# EAGLE schematic Paralysis_Assist_v1 (EAGLE 9.6.2)
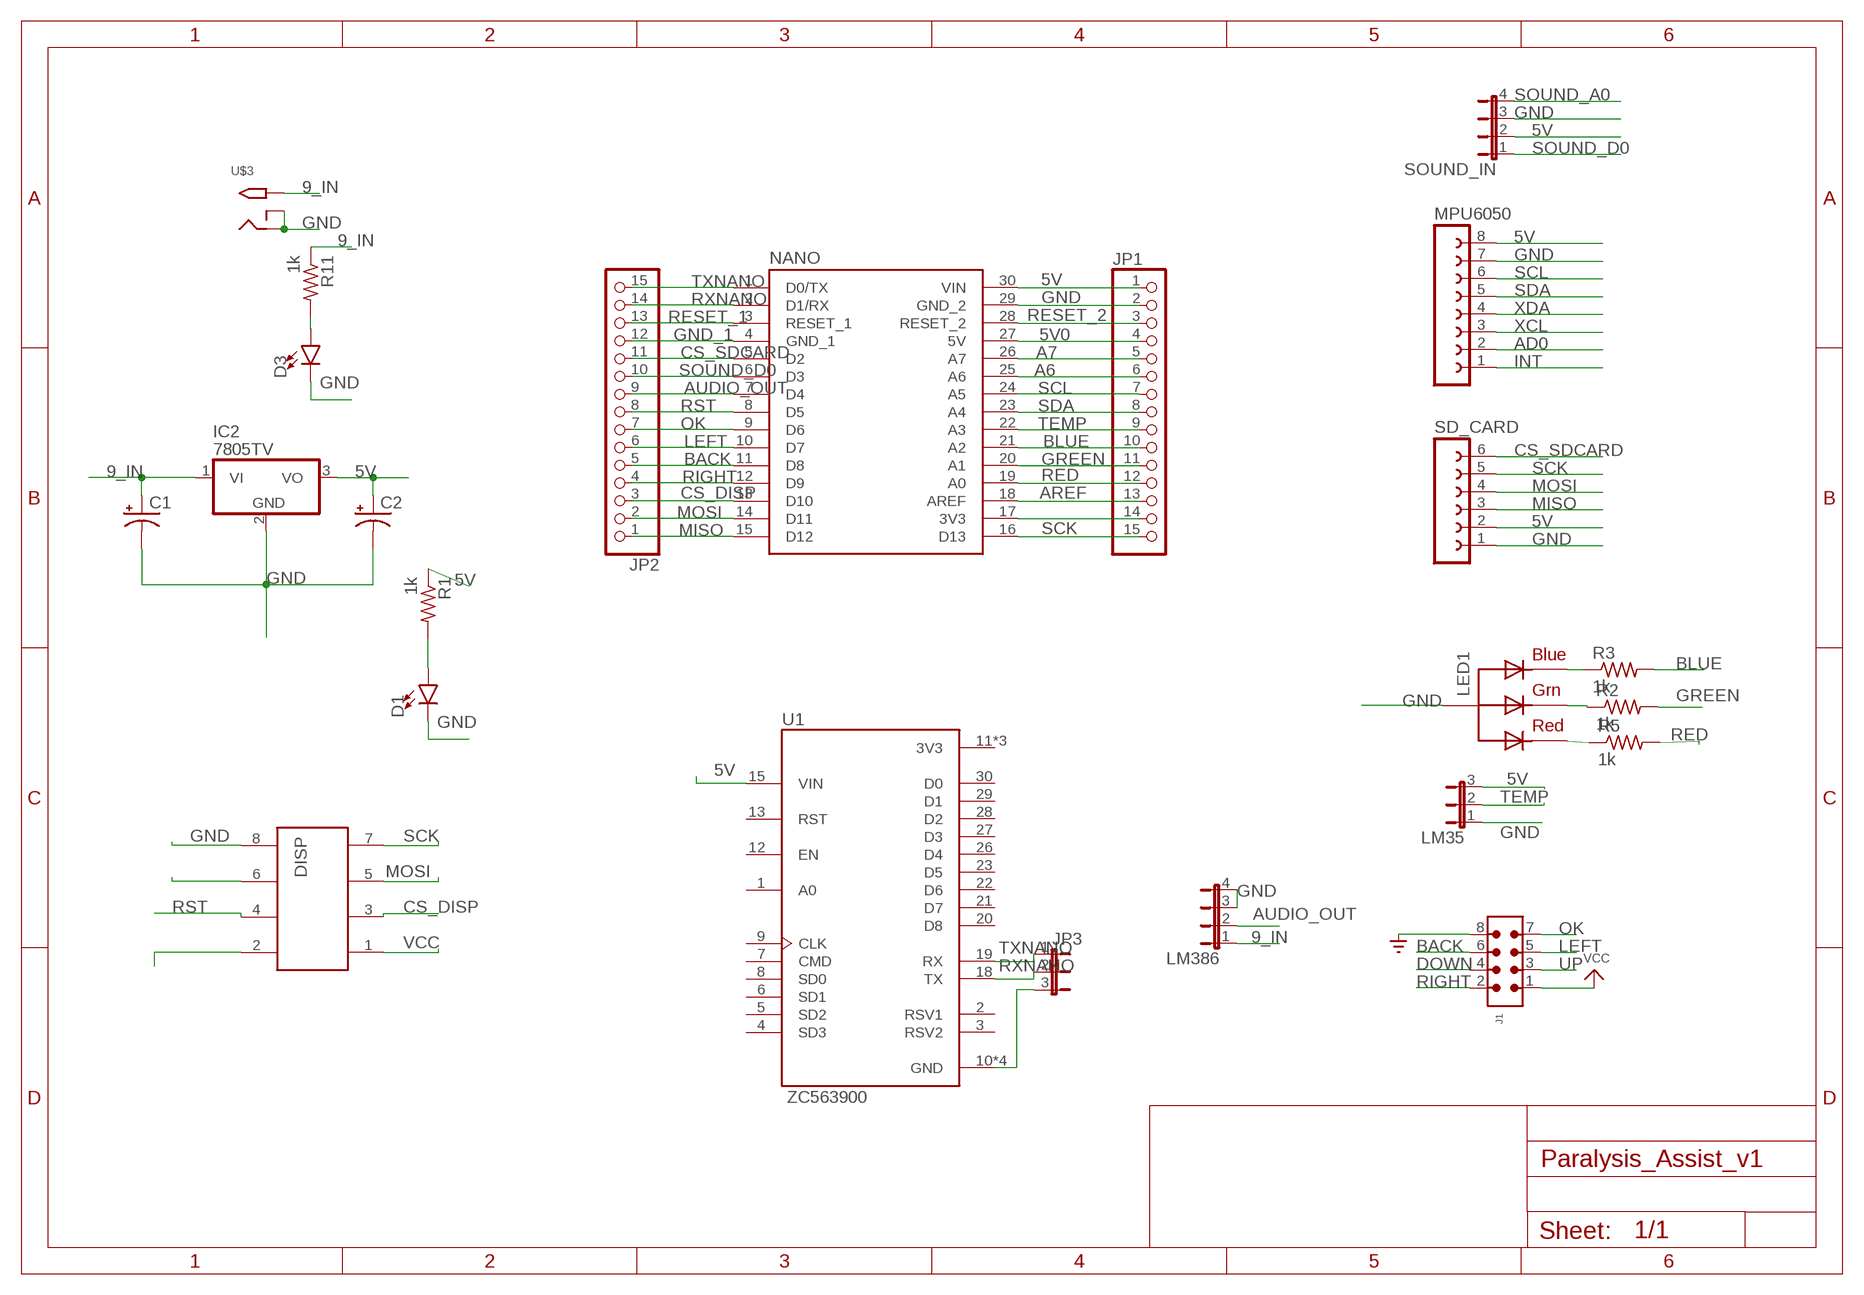
[diagram p0: schematic, sheet 1]

## Parts
C1  CPOL-USE3.5-8  [E3,5-8]
C2  CPOL-USE3.5-8  [E3,5-8]
D1  LED3MM  [LED_3MM]
D3  LED3MM  [LED_3MM]
DISP  612008235121  [612008235121]
IC2  7805TV  [TO220V]
J1  6120XX21621_61200821621  [61200821621]
JP1  PINHD-1X15  [1X15]
JP2  PINHD-1X15  [1X15]
JP3  JP2W  [JP2W]
LED1  RGBLED_CA-5MM  [LED5MMRGB]
LM35  JP2E  [JP2]
LM386  JP4E  [JP4]
MPU6050  FE08-1  [FE08]
NANO  A000005  [MODULE_A000005]
R1  1k  R-US_M0805  [M0805]
R2  1k  R-US_M0805  [M0805]
R3  1k  R-US_M0805  [M0805]
R5  1k  R-US_M0805  [M0805]
R11  1k  R-US_M0805  [M0805]
SD_CARD  FE06-1  [FE06]
SOUND_IN  JP4E  [JP4]
U1  ZC563900  [MODULE_ZC563900]
U$3  2.1MMJACKTHM  [PJ-102A]

## Nets
5V: C2.+ IC2.3(VO) JP1.1 LM35.3 MPU6050.8 NANO.30(VIN) R1.1 SD_CARD.2 SOUND_IN.2 U1.15(VIN)
5V0: JP1.4 NANO.27(5V)
9_IN: C1.+ IC2.1(VI) LM386.1 R11.1 U$3.TIP
A6: JP1.6 NANO.25(A6)
A7: JP1.5 NANO.26(A7)
AD0: MPU6050.2
AREF: JP1.13 NANO.18(AREF)
AUDIO_OUT: JP2.9 LM386.2 NANO.7(D4)
BACK: J1.6 JP2.5 NANO.11(D8)
BLUE: JP1.10 NANO.21(A2) R3.2
CS_DISP: DISP.3 JP2.3 NANO.13(D10)
CS_SDCARD: JP2.11 NANO.5(D2) SD_CARD.6
DOWN: J1.4
GND: C1.- C2.- D1.K(C) D3.K(C) DISP.8 IC2.2(GND) J1.8 JP1.2 LED1.2(VCC) LM35.1 LM386.3 LM386.4 MPU6050.7 NANO.29(GND_2) SD_CARD.1 SOUND_IN.3 U$3.RING U$3.RING_SW ; supply symbol labelled SUPPLY0_GND_
GND_1: JP2.12 NANO.4(GND_1)
GREEN: JP1.11 NANO.20(A1) R2.2
INT: MPU6050.1
LEFT: J1.5 JP2.6 NANO.10(D7)
MISO: JP2.1 NANO.15(D12) SD_CARD.3
MOSI: DISP.5 JP2.2 NANO.14(D11) SD_CARD.4
N$1: DISP.2
N$2: D3.A R11.2
N$3: D1.A R1.2
N$4: LED1.4(BLUE) R3.1
N$5: DISP.6
N$6: LED1.3(GREEN) R2.1
N$7: LED1.1(RED) R5.1
N$8: JP1.14 NANO.17(3V3)
N$10: JP3.3 U1.10(GND) U1.14(GND) U1.17(GND) U1.24(GND)
OK: J1.7 JP2.7 NANO.9(D6)
RED: JP1.12 NANO.19(A0) R5.2
RESET_1: JP2.13 NANO.3(RESET_1)
RESET_2: JP1.3 NANO.28(RESET_2)
RIGHT: J1.2 JP2.4 NANO.12(D9)
RST: DISP.4 JP2.8 NANO.8(D5)
RXNANO: JP2.14 JP3.2 NANO.2(D1/RX) U1.18(TX)
SCK: DISP.7 JP1.15 NANO.16(D13) SD_CARD.5
SCL: JP1.7 MPU6050.6 NANO.24(A5)
SDA: JP1.8 MPU6050.5 NANO.23(A4)
SOUND_A0: SOUND_IN.4
SOUND_D0: JP2.10 NANO.6(D3) SOUND_IN.1
TEMP: JP1.9 LM35.2 NANO.22(A3)
TXNANO: JP2.15 JP3.1 NANO.1(D0/TX) U1.19(RX)
UP: J1.3
VCC: DISP.1 J1.1
XCL: MPU6050.3
XDA: MPU6050.4
Unconnected: U1.1(A0) U1.2(RSV1) U1.3(RSV2) U1.4(SD3) U1.5(SD2) U1.6(SD1) U1.7(CMD) U1.8(SD0) U1.9(CLK) U1.12(EN) U1.13(RST) U1.20(D8) U1.21(D7) U1.22(D6) U1.23(D5) U1.26(D4) U1.27(D3) U1.28(D2) U1.29(D1) U1.30(D0)

## Power pins joined to a net without a drawn wire
3V3: U1.11(3V3) U1.16(3V3) U1.25(3V3)

## Library data of the parts
C1 C2 = adafruit:CPOL-US: POLARIZED CAPACITOR, American symbol
D1 D3 = SparkFun-LED:LED: LED (Generic) Standard schematic elements and footprints for 5mm, 3mm, 1206, and 0603 sized LEDs. Generic LEDs with no color specified.; PROD_ID: DIO-08794
DISP = Wurth_Elektronik_Electromechanic_Wire_to_Board_Connectors_rev19a:612008235121: WR-BHD 2.54mm Male Box Header High Temperature, 8 Pins=>Code : Con_WTB_BHD_2.54_Male_THT_RS_612008235121 <http://katalog.we-online.de/media/thumbs2/eican/thb_Con_WTB_BHD_2.54_Male_THT_RS_6120xx235121_pf2.jpg> Details see: http://katalog.we-online.de/en/em/612_0xx_235_121 Created 2014-06-05, Karrer Zheng 2014 (C) Würth Elektronik
IC2 = linear:78*: Positive VOLTAGE REGULATOR Source: http://cache.national.com/ds/LM/LM78L05.pdf http://www.fairchildsemi.com/ds/LM/LM7805.pdf
J1 = Wurth_Connectors_WR-BHD:6120XX21621_61200821621: WR-BHD 2.54 mm Male Box Header KIND PROPERTIES: Pitch 2.54 mm Gender:Male MATERIAL PROPERTIES: Insulator Material:PBT Insulator Flammability Rating UL94 V-0 Insulator Color:Black Contact Material :Copper Alloy Contact Plating :Gold Contact Type: Stamped GENERAL INFORMATION: Operating Temperature:-40 °C up to +125 °C Compliance:RoHS Working Voltage: 250 V (AC) Withstanding Voltage:500 V (AC) Contact Resistance: 20 mΩ Insulation Resistance:1000 MΩ CERTIFICATION: UL Approval:E323964 PACKAGING PROPERTIES Packaging :Tray <https://katalog.we-online.com/media/images/v2/o32884v209%20Family_WR-BHD_6120xx21621.jpg> Details see: https://katalog.we-online.com/en/em/BHD_2_54_MALE_BOX_HEADER_6120XX21621 Updated by Yingchun,Shan 2019-10-29 2019 (C) Würth Elektronik; CONTACT-RESISTANCE: 20mOhm; DATASHEET-URL: https://katalog.we-online.com/em/datasheet/61200821621.pdf; GENDER: Male; IR: 3A; L: 17.82mm; MATES: WR-BHD 2.54mm Female IDC Connector with Strain Relief; MOUNT: THT; PACKAGING: Tray; PART-NUMBER: 61200821621; PINS: 8; PITCH: 2.54mm; TOL-R: max.; TYPE: Straight; WORKING-VOLTAGE: 250V(AC)
JP1 JP2 = adafruit:PINHD-1X15: PIN HEADER
JP3 = jumper:JP2W: JUMPER
LED1 = adafruit:RGBLED_CA: RGB LED, common-anode 5MM Staggered pins 5mm Piranha package http://www.ladyada.net/library/pcb/eaglelibrary.html
LM35 = jumper:JP2E: JUMPER
LM386 SOUND_IN = jumper:JP4E: JUMPER
MPU6050 = con-lsta:FE08-1: FEMALE HEADER; OC_FARNELL: unknown; OC_NEWARK: unknown
NANO = A000005:A000005: CLOCK SAW OSCILLATOR SEAM7050 T& Check prices <https://pricing.snapeda.com/parts/A000005/Arduino/view-part?ref=eda>; AVAILABILITY: Good; DESCRIPTION: ATmega328 Arduino Nano AVR® ATmega AVR MCU 8-Bit Embedded Evaluation Board; MF: Arduino; MP: A000005; PACKAGE: None; PRICE: None; PURCHASE-URL: https://pricing.snapeda.com/search/part/A000005/?ref=eda
R1-R3 R5 R11 = adafruit:R-US_: RESISTOR, American symbol
SD_CARD = con-lsta:FE06-1: FEMALE HEADER; OC_FARNELL: unknown; OC_NEWARK: unknown
U1 = nodemcuZC563900:ZC563900: NodeMcu Lua ESP8266 WIFI Internet of Things Network Development Module Board; AVAILABILITY: Unavailable; DESCRIPTION: NodeMcu Lua ESP8266 WIFI Internet of Things Network Development Module Board; MF: YKS; MP: ZC563900; PACKAGE: None; PRICE: None
U$3 = adafruit:2.1MMJACK: 2.1mm x 5.5mm THM DC jack with internal switch. Digikey part #PJ-102A, 4UCON part #05537 2.1mm x 5.5mm SMT DC jack with internal switch. Digikey part #PJ-002A-SMT, 4UCON part #03267 By microbuilder.eu & adafruit.com